# Altium schematic sheet Sheet2.SchDoc
size A; SheetNumber: 1; SheetTotal: 1
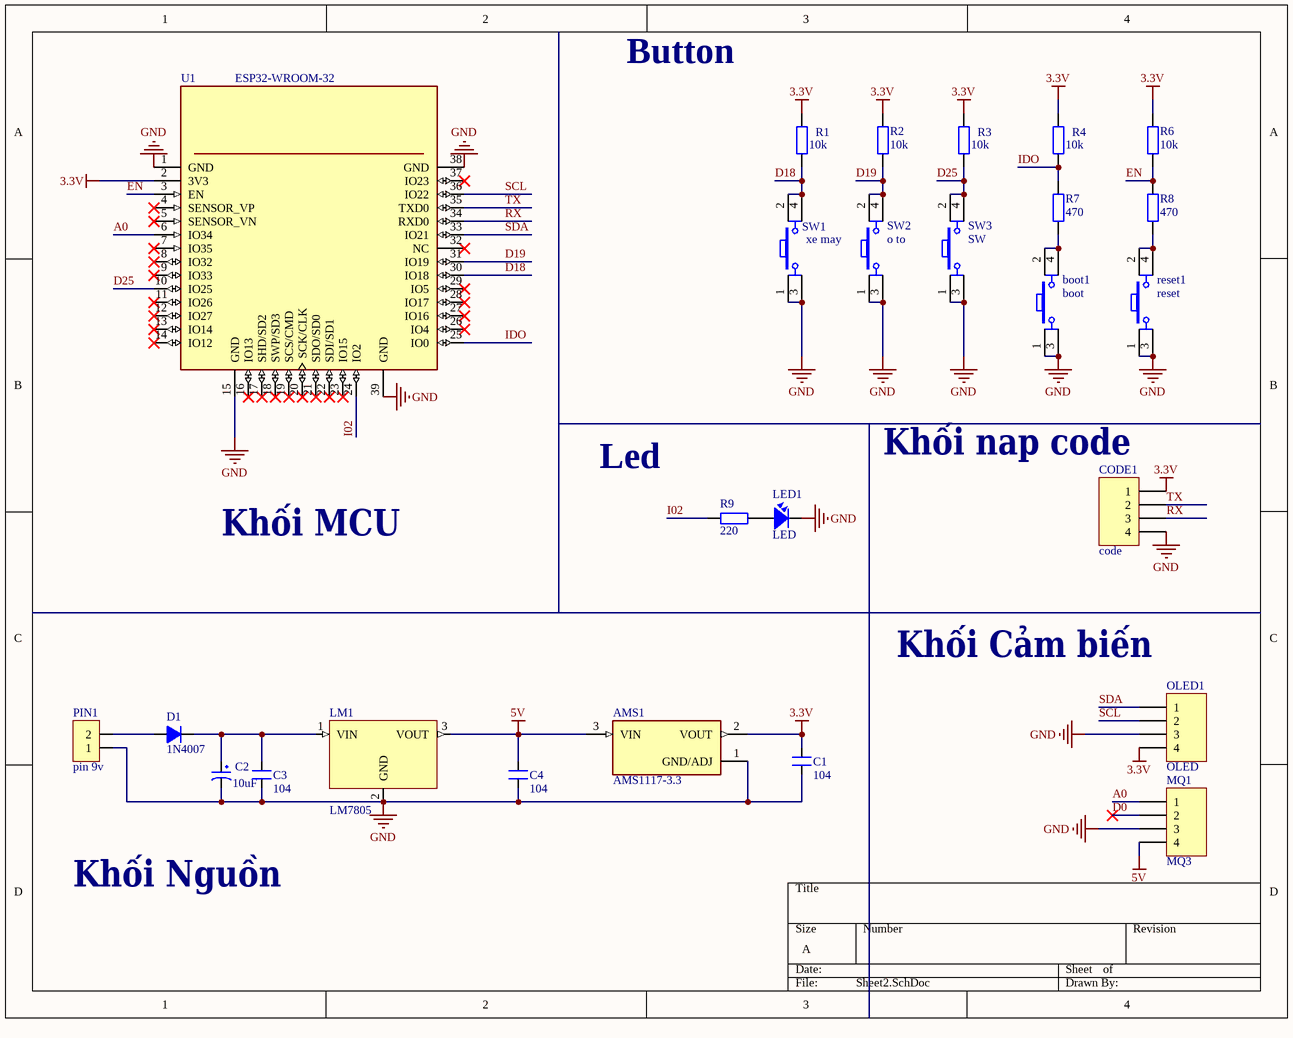
[diagram p0: Sheet2.SchDoc]

## Parts
AMS1  AMS1117-3.3  [SOT229P700X180-4N]
boot1  boot  [SW4]
C1  104  [CN2]
C2  10uF  [CP1/2]
C3  104  [CN2]
C4  104  [CN2]
CODE1  code  [HDR1X4]
D1  1N4007  [D1A]
LED1  LED  [LED-5TRED]
LM1  LM7805  [TO-220]
MQ1  MQ3  [HDR1X4]
OLED1  OLED  [HDR1X4]
PIN1  pin 9v  [HDR/Header/2]
R1  10k  [R1/4W]
R2  10k  [R1/4W]
R3  10k  [R1/4W]
R4  10k  [R1/4W]
R6  10k  [R1/4W]
R7  470  [R1/4W]
R8  470  [R1/4W]
R9  220  [R1/4W]
reset1  reset  [SW4]
SW1  xe may  [SW4]
SW2  o to  [SW4]
SW3  SW  [SW4]
U1  ESP32-WROOM-32  [MODULE_ESP32-WROOM-32]

## Nets
3.3V: AMS1.2(VOUT) C1.2 CODE1.1 OLED1.4 R1.1 R2.1 R3.1 R4.2 R6.2 U1.2(3V3)
5V: AMS1.3(VIN) C4.2 LM1.3(VOUT) MQ1.4
GND: AMS1.1(GND/ADJ) boot1.1 boot1.3 C1.1 C2.2 C3.1 C4.1 CODE1.4 LED1.2 LM1.2(GND) MQ1.3 OLED1.3 PIN1.1 reset1.1 reset1.3 SW1.1 SW1.3 SW2.1 SW2.3 SW3.1 SW3.3 U1.1(GND) U1.15(GND) U1.38(GND) U1.39(GND)
A0: MQ1.1 U1.6(IO34)
D0: MQ1.2
D18: R1.2 SW1.2 SW1.4 U1.30(IO18)
D19: R2.2 SW2.2 SW2.4 U1.31(IO19)
D25: R3.2 SW3.2 SW3.4 U1.10(IO25)
EN: R6.1 R8.2 U1.3(EN)
I02: R9.2 U1.24(IO2)
IDO: R4.1 R7.2 U1.25(IO0)
RX: CODE1.3 U1.34(RXD0)
SCL: OLED1.2 U1.36(IO22)
SDA: OLED1.1 U1.33(IO21)
TX: CODE1.2 U1.35(TXD0)
Netboot1_2: boot1.2 boot1.4 R7.1
NetC2_1: C2.1 C3.2 D1.2(K) LM1.1(VIN)
NetD1_1: D1.1(A) PIN1.2
NetLED1_1: LED1.1 R9.1
NetR8_1: R8.1 reset1.2 reset1.4

Not connected (* = marked no-connect by the designer): U1 4(SENSOR_VP)* 5(SENSOR_VN)* 7(IO35)* 8(IO32)* 9(IO33)* 11(IO26)* 12(IO27)* 13(IO14)* 14(IO12)* 16(IO13)* 17(SHD/SD2)* 18(SWP/SD3)* 19(SCS/CMD)* 20(SCK/CLK)* 21(SDO/SD0)* 22(SDI/SD1)* 23(IO15)* 26(IO4)* 27(IO16)* 28(IO17)* 29(IO5)* 32(NC)* 37(IO23)*

## Notes on the sheet
- Button
- Led
- (near CODE1) Khối nap code
- Khối MCU
- (near OLED1) Khối Cảm biến
- Khối Nguồn

## Library data of the parts
AMS1 = AMS1117-3.3: Sot223/Pkg 1-Amp 3.3-Volt Low Drop Out Voltage Regulatator; MF: Advanced Monolithic Systems; Package: SOT-223 Seeed Technology; Value: *; Check_prices: https://www.snapeda.com/parts/AMS1117-3.3/Advanced+Monolithic+Systems/view-part/?ref=eda; Price: None; Availability: Not in stock; MP: AMS1117-3.3; SnapEDA_Link: https://www.snapeda.com/parts/AMS1117-3.3/Advanced+Monolithic+Systems/view-part/?ref=snap
boot1 reset1 SW1-SW3 = SW4: Switch button 4 pin; Value: Button chip 4 pin
C1 C3 C4 = CN2: Cap np 104 => 105pF; Value: 0.1uF
C2 = CP1: Cap P  0,1uF < 22uF , 16 - 50V; Value: 10uF/50V; Description 1: 10 => 220uF/6,3V/10V - 10uF => 100uF/16V; Description 2: 0,1uF => 33uF/50V - 10uF => 22uF/63V; Description 3: 0,47uF => 10uF/100V
CODE1 MQ1 OLED1 = Header 4: Header, 4-Pin, Right Angle; LatestRevisionDate: 17-Jul-2002; LatestRevisionNote: Re-released for DXP Platform.; Publisher: Altium Limited
D1 = D1A: Diode 1A; Value: 1N4007
LED1 = LED: LED Single colour Green and Red; Value: LED 3 ly Single Colour
LM1 = LM7805: TO-220; Text Field1: 70; Text Field2: 30
PIN1 = Header 2: Header, 2-Pin
R1-R4 R6-R9 = R1/4W: Resistor 1/4W; Value: R1/4W - 1K
U1 = ESP32-WROOM-32: Bluetooth, WiFi 802.11b/g/n, Bluetooth v4.2 + EDR, Class 1, 2 and 3 Transceiver Module 2.4GHz ~ 2.5GHz Integrated, Trace Surface Mount; MF: Espressif Systems; MP: ESP32-WROOM-32D; Price: None; Package: Module Espressif Systems; Availability: Unavailable; SnapEDA_Link: https://www.snapeda.com/parts/ESP32-WROOM-32D/Espressif%20Systems/view-part/2768115/?ref=snap; Value: *